# Altium schematic sheet RK3588_GPIO_MAYBE_IMPORTANT_PINS.SchDoc
size 594 x 420 mm; SheetNumber: 11; SheetTotal: 23
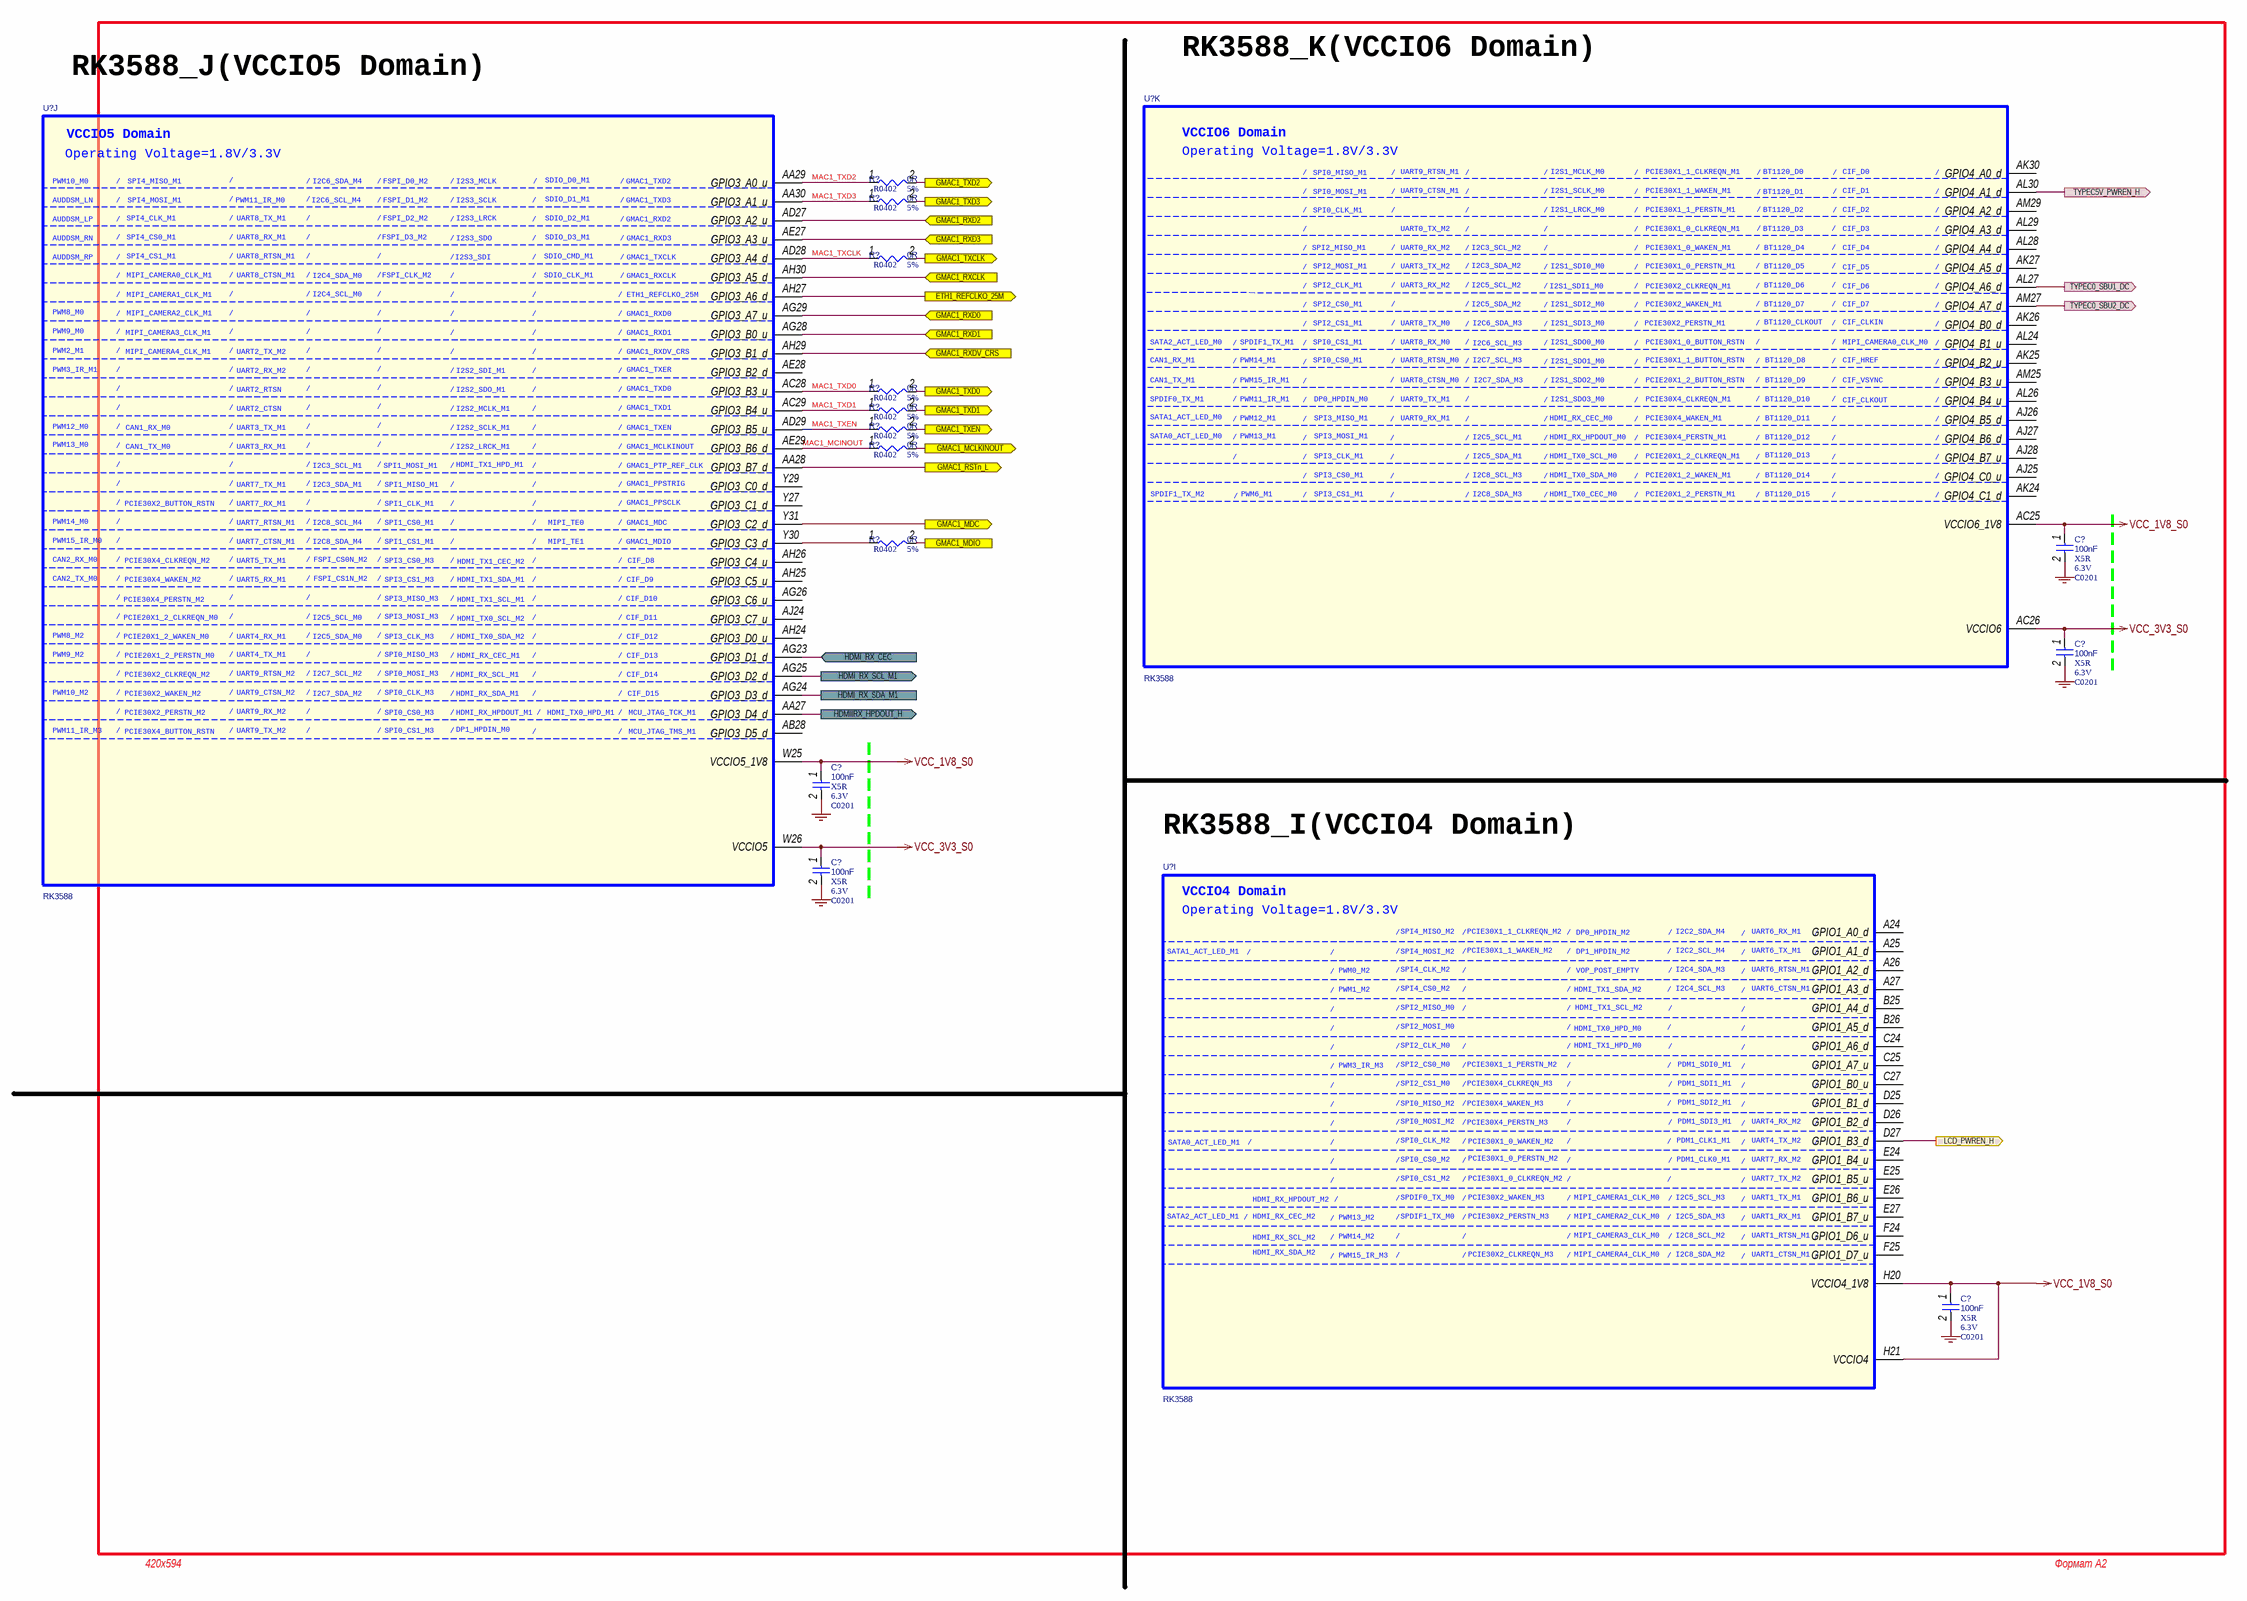
[diagram p0: RK3588_GPIO_MAYBE_IMPORTANT_PINS.SchDoc]

## Parts
(Parts that share a designator on the sheet are numbered #1, #2 ... from top to bottom, then left to right.)
C?#1  100nF  Dielectric: X5R  Voltage: 6.3V  [C0201]
C?#2  100nF  Dielectric: X5R  Voltage: 6.3V  [C0201]
C?#3  100nF  Dielectric: X5R  Voltage: 6.3V  [C0201]
C?#4  100nF  Dielectric: X5R  Voltage: 6.3V  [C0201]
C?#5  100nF  Dielectric: X5R  Voltage: 6.3V  [C0201]
R?#1  0R  Tolerance: 5%  [R0402]
R?#2  0R  Tolerance: 5%  [R0402]
R?#3  0R  Tolerance: 5%  [R0402]
R?#4  0R  Tolerance: 5%  [R0402]
R?#5  0R  Tolerance: 5%  [R0402]
R?#6  0R  Tolerance: 5%  [R0402]
R?#7  0R  Tolerance: 5%  [R0402]
R?#8  0R  Tolerance: 5%  [R0402]
U?#1  RK3588  [BGA1088_23R00X23R00X2R00]  (part K of 26)
U?#2  RK3588  [BGA1088_23R00X23R00X2R00]  (part J of 26)
U?#3  RK3588  [BGA1088_23R00X23R00X2R00]  (part I of 26)

## Ports
ETH1_REFCLKO_25M (out, see ETHERNET_PHY_RGMII[1B]), GMAC1_MCLKINOUT (out, see ETHERNET_PHY_RGMII[1B]), GMAC1_MDC (out, see ETHERNET_PHY_RGMII[1B]), GMAC1_MDIO (see ETHERNET_PHY_RGMII[1B]), GMAC1_RSTn_L (out, see ETHERNET_PHY_RGMII[1B]), GMAC1_RXCLK (in, see ETHERNET_PHY_RGMII[1B]), GMAC1_RXD0 (in, see ETHERNET_PHY_RGMII[1A]), GMAC1_RXD1 (in, see ETHERNET_PHY_RGMII[1B]), GMAC1_RXD2 (in, see ETHERNET_PHY_RGMII[1B]), GMAC1_RXD3 (in, see ETHERNET_PHY_RGMII[1B]), GMAC1_RXDV_CRS (in, see ETHERNET_PHY_RGMII[1B]), GMAC1_TXCLK (out, see ETHERNET_PHY_RGMII[1A]), GMAC1_TXD0 (out, see ETHERNET_PHY_RGMII[1A]), GMAC1_TXD1 (out, see ETHERNET_PHY_RGMII[1A]), GMAC1_TXD2 (out, see ETHERNET_PHY_RGMII[1A]), GMAC1_TXD3 (out, see ETHERNET_PHY_RGMII[1A]), GMAC1_TXEN (out, see ETHERNET_PHY_RGMII[1A]), HDMI_RX_CEC (in, see HDMI2_0_RX[3C]), HDMI_RX_SCL_M1 (out, see HDMI2_0_RX[1C]), HDMI_RX_SDA_M1 (see HDMI2_0_RX[1C]), HDMIIRX_HPDOUT_H (out, see HDMI2_0_RX[2C]), LCD_PWREN_H (out, see MIPI_D_CPHY_TX_DUAL[2B]), TYPEC0_SBU1_DC (out, see PORT_TYPE_C[2A]), TYPEC0_SBU2_DC (out, see PORT_TYPE_C[2B]), TYPEC5V_PWREN_H (out, see PORT_TYPE_C[3D])

## Nets
GND: C?#1.2 C?#2.2 C?#3.2 C?#4.2 C?#5.2
VCC_1V8_S0: C?#1.1 C?#3.1 C?#5.1 U?#1.AC25(VCCIO6_1V8) U?#2.W25(VCCIO5_1V8) U?#3.H20(VCCIO4_1V8) U?#3.H21(VCCIO4)
VCC_3V3_S0: C?#2.1 C?#4.1 U?#1.AC26(VCCIO6) U?#2.W26(VCCIO5)
ETH1_REFCLKO_25M: U?#2.AH27(GPIO3_A6_d) ; port ETH1_REFCLKO_25M
GMAC1_MCLKINOUT: R?#7.2 ; port GMAC1_MCLKINOUT
GMAC1_MDC: U?#2.Y31(GPIO3_C2_d) ; port GMAC1_MDC
GMAC1_MDIO: R?#8.2 ; port GMAC1_MDIO
GMAC1_RSTn_L: U?#2.AA28(GPIO3_B7_d) ; port GMAC1_RSTn_L
GMAC1_RXCLK: U?#2.AH30(GPIO3_A5_d) ; port GMAC1_RXCLK
GMAC1_RXD0: U?#2.AG29(GPIO3_A7_u) ; port GMAC1_RXD0
GMAC1_RXD1: U?#2.AG28(GPIO3_B0_u) ; port GMAC1_RXD1
GMAC1_RXD2: U?#2.AD27(GPIO3_A2_u) ; port GMAC1_RXD2
GMAC1_RXD3: U?#2.AE27(GPIO3_A3_u) ; port GMAC1_RXD3
GMAC1_RXDV_CRS: U?#2.AH29(GPIO3_B1_d) ; port GMAC1_RXDV_CRS
GMAC1_TXCLK: R?#3.2 ; port GMAC1_TXCLK
GMAC1_TXD0: R?#4.2 ; port GMAC1_TXD0
GMAC1_TXD1: R?#5.2 ; port GMAC1_TXD1
GMAC1_TXD2: R?#1.2 ; port GMAC1_TXD2
GMAC1_TXD3: R?#2.2 ; port GMAC1_TXD3
GMAC1_TXEN: R?#6.2 ; port GMAC1_TXEN
HDMI_RX_CEC: U?#2.AG23(GPIO3_D1_d) ; port HDMI_RX_CEC
HDMI_RX_SCL_M1: U?#2.AG25(GPIO3_D2_d) ; port HDMI_RX_SCL_M1
HDMI_RX_SDA_M1: U?#2.AG24(GPIO3_D3_d) ; port HDMI_RX_SDA_M1
HDMIIRX_HPDOUT_H: U?#2.AA27(GPIO3_D4_d) ; port HDMIIRX_HPDOUT_H
LCD_PWREN_H: U?#3.D27(GPIO1_B3_d) ; port LCD_PWREN_H
MAC1_MCINOUT: R?#7.1 U?#2.AE29(GPIO3_B6_d)
MAC1_TXCLK: R?#3.1 U?#2.AD28(GPIO3_A4_d)
MAC1_TXD0: R?#4.1 U?#2.AC28(GPIO3_B3_u)
MAC1_TXD1: R?#5.1 U?#2.AC29(GPIO3_B4_u)
MAC1_TXD2: R?#1.1 U?#2.AA29(GPIO3_A0_u)
MAC1_TXD3: R?#2.1 U?#2.AA30(GPIO3_A1_u)
MAC1_TXEN: R?#6.1 U?#2.AD29(GPIO3_B5_u)
TYPEC0_SBU1_DC: U?#1.AL27(GPIO4_A6_d) ; port TYPEC0_SBU1_DC
TYPEC0_SBU2_DC: U?#1.AM27(GPIO4_A7_d) ; port TYPEC0_SBU2_DC
TYPEC5V_PWREN_H: U?#1.AL30(GPIO4_A1_d) ; port TYPEC5V_PWREN_H
NetR?#8_1: R?#8.1 U?#2.Y30(GPIO3_C3_d)

Not connected (* = marked no-connect by the designer): U?#1 AJ25(GPIO4_C0_u) AJ26(GPIO4_B5_d) AJ27(GPIO4_B6_d) AJ28(GPIO4_B7_u) AK24(GPIO4_C1_d) AK25(GPIO4_B2_u) AK26(GPIO4_B0_d) AK27(GPIO4_A5_d) AK30(GPIO4_A0_d) AL24(GPIO4_B1_u) AL26(GPIO4_B4_u) AL28(GPIO4_A4_d) AL29(GPIO4_A3_d) AM25(GPIO4_B3_u) AM29(GPIO4_A2_d); U?#2 AB28(GPIO3_D5_d) AE28(GPIO3_B2_d) AG26(GPIO3_C6_u) AH24(GPIO3_D0_u) AH25(GPIO3_C5_u) AH26(GPIO3_C4_u) AJ24(GPIO3_C7_u) Y27(GPIO3_C1_d) Y29(GPIO3_C0_d); U?#3 A24(GPIO1_A0_d) A25(GPIO1_A1_d) A26(GPIO1_A2_d) A27(GPIO1_A3_d) B25(GPIO1_A4_d) B26(GPIO1_A5_d) C24(GPIO1_A6_d) C25(GPIO1_A7_u) C27(GPIO1_B0_u) D25(GPIO1_B1_d) D26(GPIO1_B2_d) E24(GPIO1_B4_u) E25(GPIO1_B5_u) E26(GPIO1_B6_u) E27(GPIO1_B7_u) F24(GPIO1_D6_u) F25(GPIO1_D7_u)

## Notes on the sheet
- RK3588_K(VCCIO6 Domain)
- RK3588_J(VCCIO5 Domain)
- RK3588_I(VCCIO4 Domain)
- 420x594
- Формат А2
- (in symbol SOC_RK3588, part I) VCCIO4 Domain; Operating Voltage=1.8V/3.3V; /; SPI4_MISO_M2; PCIE30X1_1_CLKREQN_M2; DP0_HPDIN_M2; I2C2_SDA_M4; UART6_RX_M1; SATA1_ACT_LED_M1; SPI4_MOSI_M2; PCIE30X1_1_WAKEN_M2; DP1_HPDIN_M2; I2C2_SCL_M4; UART6_TX_M1; PWM0_M2; SPI4_CLK_M2; VOP_POST_EMPTY; I2C4_SDA_M3; UART6_RTSN_M1; PWM1_M2; SPI4_CS0_M2; HDMI_TX1_SDA_M2; I2C4_SCL_M3; UART6_CTSN_M1; SPI2_MISO_M0; HDMI_TX1_SCL_M2; SPI2_MOSI_M0; HDMI_TX0_HPD_M0; SPI2_CLK_M0; HDMI_TX1_HPD_M0; PWM3_IR_M3; SPI2_CS0_M0; PCIE30X1_1_PERSTN_M2; PDM1_SDI0_M1; SPI2_CS1_M0; PCIE30X4_CLKREQN_M3; PDM1_SDI1_M1; SPI0_MISO_M2; PCIE30X4_WAKEN_M3; PDM1_SDI2_M1; SPI0_MOSI_M2; PCIE30X4_PERSTN_M3; PDM1_SDI3_M1; UART4_RX_M2; SATA0_ACT_LED_M1; SPI0_CLK_M2; PCIE30X1_0_WAKEN_M2; PDM1_CLK1_M1; UART4_TX_M2; SPI0_CS0_M2; PCIE30X1_0_PERSTN_M2; PDM1_CLK0_M1; UART7_RX_M2; SPI0_CS1_M2; PCIE30X1_0_CLKREQN_M2; UART7_TX_M2; HDMI_RX_HPDOUT_M2; SPDIF0_TX_M0; PCIE30X2_WAKEN_M3; MIPI_CAMERA1_CLK_M0; I2C5_SCL_M3; UART1_TX_M1; SATA2_ACT_LED_M1; HDMI_RX_CEC_M2; PWM13_M2; SPDIF1_TX_M0; PCIE30X2_PERSTN_M3; MIPI_CAMERA2_CLK_M0; I2C5_SDA_M3; UART1_RX_M1; HDMI_RX_SCL_M2; PWM14_M2; MIPI_CAMERA3_CLK_M0; I2C8_SCL_M2; UART1_RTSN_M1; HDMI_RX_SDA_M2; PWM15_IR_M3; PCIE30X2_CLKREQN_M3; MIPI_CAMERA4_CLK_M0; I2C8_SDA_M2; UART1_CTSN_M1
- (in symbol SOC_RK3588, part J) VCCIO5 Domain; Operating Voltage=1.8V/3.3V; PWM10_M0; /; SPI4_MISO_M1; I2C6_SDA_M4; FSPI_D0_M2; I2S3_MCLK; SDIO_D0_M1; GMAC1_TXD2; AUDDSM_LN; SPI4_MOSI_M1; PWM11_IR_M0; I2C6_SCL_M4; FSPI_D1_M2; I2S3_SCLK; SDIO_D1_M1; GMAC1_TXD3; AUDDSM_LP; SPI4_CLK_M1; UART8_TX_M1; FSPI_D2_M2; I2S3_LRCK; SDIO_D2_M1; GMAC1_RXD2; AUDDSM_RN; SPI4_CS0_M1; UART8_RX_M1; FSPI_D3_M2; I2S3_SDO; SDIO_D3_M1; GMAC1_RXD3; AUDDSM_RP; SPI4_CS1_M1; UART8_RTSN_M1; I2S3_SDI; SDIO_CMD_M1; GMAC1_TXCLK; MIPI_CAMERA0_CLK_M1; UART8_CTSN_M1; I2C4_SDA_M0; FSPI_CLK_M2; SDIO_CLK_M1; GMAC1_RXCLK; MIPI_CAMERA1_CLK_M1; I2C4_SCL_M0; ETH1_REFCLKO_25M; PWM8_M0; MIPI_CAMERA2_CLK_M1; GMAC1_RXD0; PWM9_M0; MIPI_CAMERA3_CLK_M1; GMAC1_RXD1; PWM2_M1; MIPI_CAMERA4_CLK_M1; UART2_TX_M2; GMAC1_RXDV_CRS; PWM3_IR_M1; UART2_RX_M2; I2S2_SDI_M1; GMAC1_TXER; UART2_RTSN; I2S2_SDO_M1; GMAC1_TXD0; UART2_CTSN; I2S2_MCLK_M1; GMAC1_TXD1; PWM12_M0; CAN1_RX_M0; UART3_TX_M1; I2S2_SCLK_M1; GMAC1_TXEN; PWM13_M0; CAN1_TX_M0; UART3_RX_M1; I2S2_LRCK_M1; GMAC1_MCLKINOUT; I2C3_SCL_M1; SPI1_MOSI_M1; HDMI_TX1_HPD_M1; GMAC1_PTP_REF_CLK; UART7_TX_M1; I2C3_SDA_M1; SPI1_MISO_M1; GMAC1_PPSTRIG; PCIE30X2_BUTTON_RSTN; UART7_RX_M1; SPI1_CLK_M1; GMAC1_PPSCLK; PWM14_M0; UART7_RTSN_M1; I2C8_SCL_M4; SPI1_CS0_M1; MIPI_TE0; GMAC1_MDC; PWM15_IR_M0; UART7_CTSN_M1; I2C8_SDA_M4; SPI1_CS1_M1; MIPI_TE1; GMAC1_MDIO; CAN2_RX_M0; PCIE30X4_CLKREQN_M2; UART5_TX_M1; FSPI_CS0N_M2; SPI3_CS0_M3; HDMI_TX1_CEC_M2; CIF_D8; CAN2_TX_M0; PCIE30X4_WAKEN_M2; UART5_RX_M1; FSPI_CS1N_M2; SPI3_CS1_M3; HDMI_TX1_SDA_M1; CIF_D9; PCIE30X4_PERSTN_M2; SPI3_MISO_M3; HDMI_TX1_SCL_M1; CIF_D10; PCIE20X1_2_CLKREQN_M0; I2C5_SCL_M0; SPI3_MOSI_M3; HDMI_TX0_SCL_M2; CIF_D11; PWM8_M2; PCIE20X1_2_WAKEN_M0; UART4_RX_M1; I2C5_SDA_M0; SPI3_CLK_M3; HDMI_TX0_SDA_M2; CIF_D12; PWM9_M2; PCIE20X1_2_PERSTN_M0; UART4_TX_M1; SPI0_MISO_M3; HDMI_RX_CEC_M1; CIF_D13; PCIE30X2_CLKREQN_M2; UART9_RTSN_M2; I2C7_SCL_M2; SPI0_MOSI_M3; HDMI_RX_SCL_M1; CIF_D14; PWM10_M2; PCIE30X2_WAKEN_M2; UART9_CTSN_M2; I2C7_SDA_M2; SPI0_CLK_M3; HDMI_RX_SDA_M1; CIF_D15; PCIE30X2_PERSTN_M2; UART9_RX_M2; SPI0_CS0_M3; HDMI_RX_HPDOUT_M1; HDMI_TX0_HPD_M1; MCU_JTAG_TCK_M1; DP1_HPDIN_M0; PWM11_IR_M3; PCIE30X4_BUTTON_RSTN; UART9_TX_M2; SPI0_CS1_M3; MCU_JTAG_TMS_M1
- (in symbol SOC_RK3588, part K) VCCIO6 Domain; Operating Voltage=1.8V/3.3V; /; SPI0_MISO_M1; UART9_RTSN_M1; I2S1_MCLK_M0; PCIE30X1_1_CLKREQN_M1; BT1120_D0; CIF_D0; SPI0_MOSI_M1; UART9_CTSN_M1; I2S1_SCLK_M0; PCIE30X1_1_WAKEN_M1; BT1120_D1; CIF_D1; SPI0_CLK_M1; I2S1_LRCK_M0; PCIE30X1_1_PERSTN_M1; BT1120_D2; CIF_D2; UART0_TX_M2; PCIE30X1_0_CLKREQN_M1; BT1120_D3; CIF_D3; SPI2_MISO_M1; UART0_RX_M2; I2C3_SCL_M2; PCIE30X1_0_WAKEN_M1; BT1120_D4; CIF_D4; SPI2_MOSI_M1; UART3_TX_M2; I2C3_SDA_M2; I2S1_SDI0_M0; PCIE30X1_0_PERSTN_M1; BT1120_D5; CIF_D5; SPI2_CLK_M1; UART3_RX_M2; I2C5_SCL_M2; I2S1_SDI1_M0; PCIE30X2_CLKREQN_M1; BT1120_D6; CIF_D6; SPI2_CS0_M1; I2C5_SDA_M2; I2S1_SDI2_M0; PCIE30X2_WAKEN_M1; BT1120_D7; CIF_D7; SPI2_CS1_M1; UART8_TX_M0; I2C6_SDA_M3; I2S1_SDI3_M0; PCIE30X2_PERSTN_M1; BT1120_CLKOUT; CIF_CLKIN; SATA2_ACT_LED_M0; SPDIF1_TX_M1; SPI0_CS1_M1; UART8_RX_M0; I2C6_SCL_M3; I2S1_SDO0_M0; PCIE30X1_0_BUTTON_RSTN; MIPI_CAMERA0_CLK_M0; CAN1_RX_M1; PWM14_M1; SPI0_CS0_M1; UART8_RTSN_M0; I2C7_SCL_M3; I2S1_SDO1_M0; PCIE30X1_1_BUTTON_RSTN; BT1120_D8; CIF_HREF; CAN1_TX_M1; PWM15_IR_M1; UART8_CTSN_M0; I2C7_SDA_M3; I2S1_SDO2_M0; PCIE20X1_2_BUTTON_RSTN; BT1120_D9; CIF_VSYNC; SPDIF0_TX_M1; PWM11_IR_M1; DP0_HPDIN_M0; UART9_TX_M1; I2S1_SDO3_M0; PCIE30X4_CLKREQN_M1; BT1120_D10; CIF_CLKOUT; SATA1_ACT_LED_M0; PWM12_M1; SPI3_MISO_M1; UART9_RX_M1; HDMI_RX_CEC_M0; PCIE30X4_WAKEN_M1; BT1120_D11; SATA0_ACT_LED_M0; PWM13_M1; SPI3_MOSI_M1; I2C5_SCL_M1; HDMI_RX_HPDOUT_M0; PCIE30X4_PERSTN_M1; BT1120_D12; SPI3_CLK_M1; I2C5_SDA_M1; HDMI_TX0_SCL_M0; PCIE20X1_2_CLKREQN_M1; BT1120_D13; SPI3_CS0_M1; I2C8_SCL_M3; HDMI_TX0_SDA_M0; PCIE20X1_2_WAKEN_M1; BT1120_D14; SPDIF1_TX_M2; PWM6_M1; SPI3_CS1_M1; I2C8_SDA_M3; HDMI_TX0_CEC_M0; PCIE20X1_2_PERSTN_M1; BT1120_D15

## Library data of the parts
C?#1 = CAP NP_Dup1: cap,100.00nF,+/-10%,6.3V,X5R,C0201; Part Reference: C1909; Manufacturer: TDK; RK PN: C0603X5R0J104K030BC; Priority: A; Tolerance: 10%; PCB Footprint: C0201; Value: 100nF; Part Type: C0201; Manufacturer PN: C0603X5R0J104K030BC; Created by: JJJ
C?#2 = CAP NP_Dup1: cap,100.00nF,+/-10%,6.3V,X5R,C0201; Part Reference: C1908; Manufacturer: TDK; RK PN: C0603X5R0J104K030BC; Priority: A; Tolerance: 10%; PCB Footprint: C0201; Value: 100nF; Part Type: C0201; Manufacturer PN: C0603X5R0J104K030BC; Created by: JJJ
C?#3 = CAP NP_Dup1: cap,100.00nF,+/-10%,6.3V,X5R,C0201; Part Reference: C1903; Manufacturer: TDK; RK PN: C0603X5R0J104K030BC; Priority: A; Tolerance: 10%; PCB Footprint: C0201; Value: 100nF; Part Type: C0201; Manufacturer PN: C0603X5R0J104K030BC; Created by: JJJ
C?#4 = CAP NP_Dup1: cap,100.00nF,+/-10%,6.3V,X5R,C0201; Part Reference: C1902; Manufacturer PN: C0603X5R0J104K030BC; Manufacturer: TDK; Tolerance: 10%; Priority: A; PCB Footprint: C0201; Value: 100nF; Created by: JJJ; Part Type: C0201; RK PN: C0603X5R0J104K030BC
C?#5 = CAP NP_Dup1: cap,100.00nF,+/-10%,6.3V,X5R,C0201; Part Reference: C1907; Manufacturer PN: C0603X5R0J104K030BC; Manufacturer: TDK; Tolerance: 10%; Priority: A; PCB Footprint: C0201; Value: 100nF; Created by: JJJ; Part Type: C0201; RK PN: C0603X5R0J104K030BC
R?#1 = RESISTOR_Dup2: НЁУГєсД¤µзЧи,0R,+/-5%,R0402,1/16W.; Part Reference: R1512; Manufacturer: YAGEO; RK PN: RC0402JR-070RL; Priority: A; Wattage: 1/16W; PCB Footprint: R0402; Value: 0R; Part Type: НЁУГєсД¤µзЧи; Manufacturer PN: RC0402JR-070RL; Created by: YTL
R?#2 = RESISTOR_Dup2: НЁУГєсД¤µзЧи,0R,+/-5%,R0402,1/16W.; Part Reference: R1513; Manufacturer PN: RC0402JR-070RL; Manufacturer: YAGEO; Wattage: 1/16W; Priority: A; PCB Footprint: R0402; Value: 0R; Created by: YTL; Part Type: НЁУГєсД¤µзЧи; RK PN: RC0402JR-070RL
R?#3-R?#8 = RESISTOR_Dup2: НЁУГєсД¤µзЧи,0R,+/-5%,R0402,1/16W.; Part Reference: R1514; Manufacturer: YAGEO; RK PN: RC0402JR-070RL; Priority: A; Wattage: 1/16W; PCB Footprint: R0402; Value: 0R; Part Type: НЁУГєсД¤µзЧи; Manufacturer PN: RC0402JR-070RL; Created by: YTL
U?#1-U?#3 = SOC_RK3588: ROCKCHIP SOC; Part Reference: U1000; Manufacturer: Rockchip (ИрРѕОў); SWAP_INFO: (S1+S2+S3+S4+S5+S6+S7+S8+S9+S10+S11+S12+S13+S14+S15+S16+S17+S18+S19+S20+S21+S22+S23+S24+S25+S26); SPLIT_INST: TRUE; Priority: A; Value: RK3588; Created by: YWQ; Manufacturer PN: RK3588; Part Type: SOC; RK PN: RK3588; PCB Footprint: BGA1088_23R00X23R00X2R00